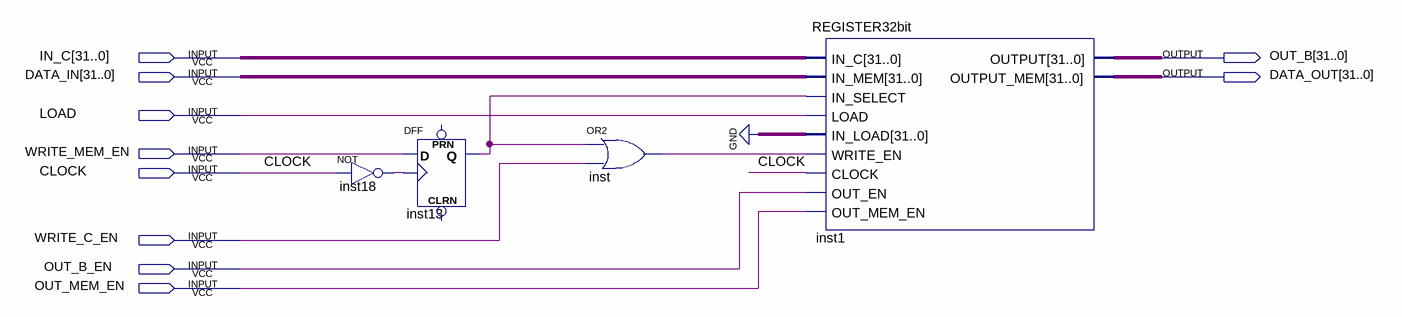
[diagram p0: schematic sheet]
// Quartus schematic MDR.bdf as structural Verilog: 4 symbols, 10 pins
module MDR (
  input  [31:0] IN_C,
  input  [31:0] DATA_IN,
  input  LOAD,
  input  WRITE_MEM_EN,
  input  CLOCK,
  input  WRITE_C_EN,
  input  OUT_B_EN,
  input  OUT_MEM_EN,
  output [31:0] OUT_B,
  output [31:0] DATA_OUT
);

  wire inst13_q, inst18_out, inst_out;

  not inst18 (inst18_out, CLOCK);
  DFF inst13 (.CLK(inst18_out), .D(WRITE_MEM_EN), .Q(inst13_q));  // open: CLRN, PRN
  or inst (inst_out, inst13_q, WRITE_C_EN);
  REGISTER32bit inst1 (
    .IN_C(IN_C), .IN_MEM(DATA_IN), .IN_SELECT(inst13_q), .LOAD(LOAD), .IN_LOAD({32{1'b0}}),
    .WRITE_EN(inst_out), .CLOCK(CLOCK), .OUT_EN(OUT_B_EN), .OUT_MEM_EN(OUT_MEM_EN), .OUTPUT(OUT_B),
    .OUTPUT_MEM(DATA_OUT));
endmodule
